# EAGLE design Entrenadorv01 (EAGLE 9.6.2)
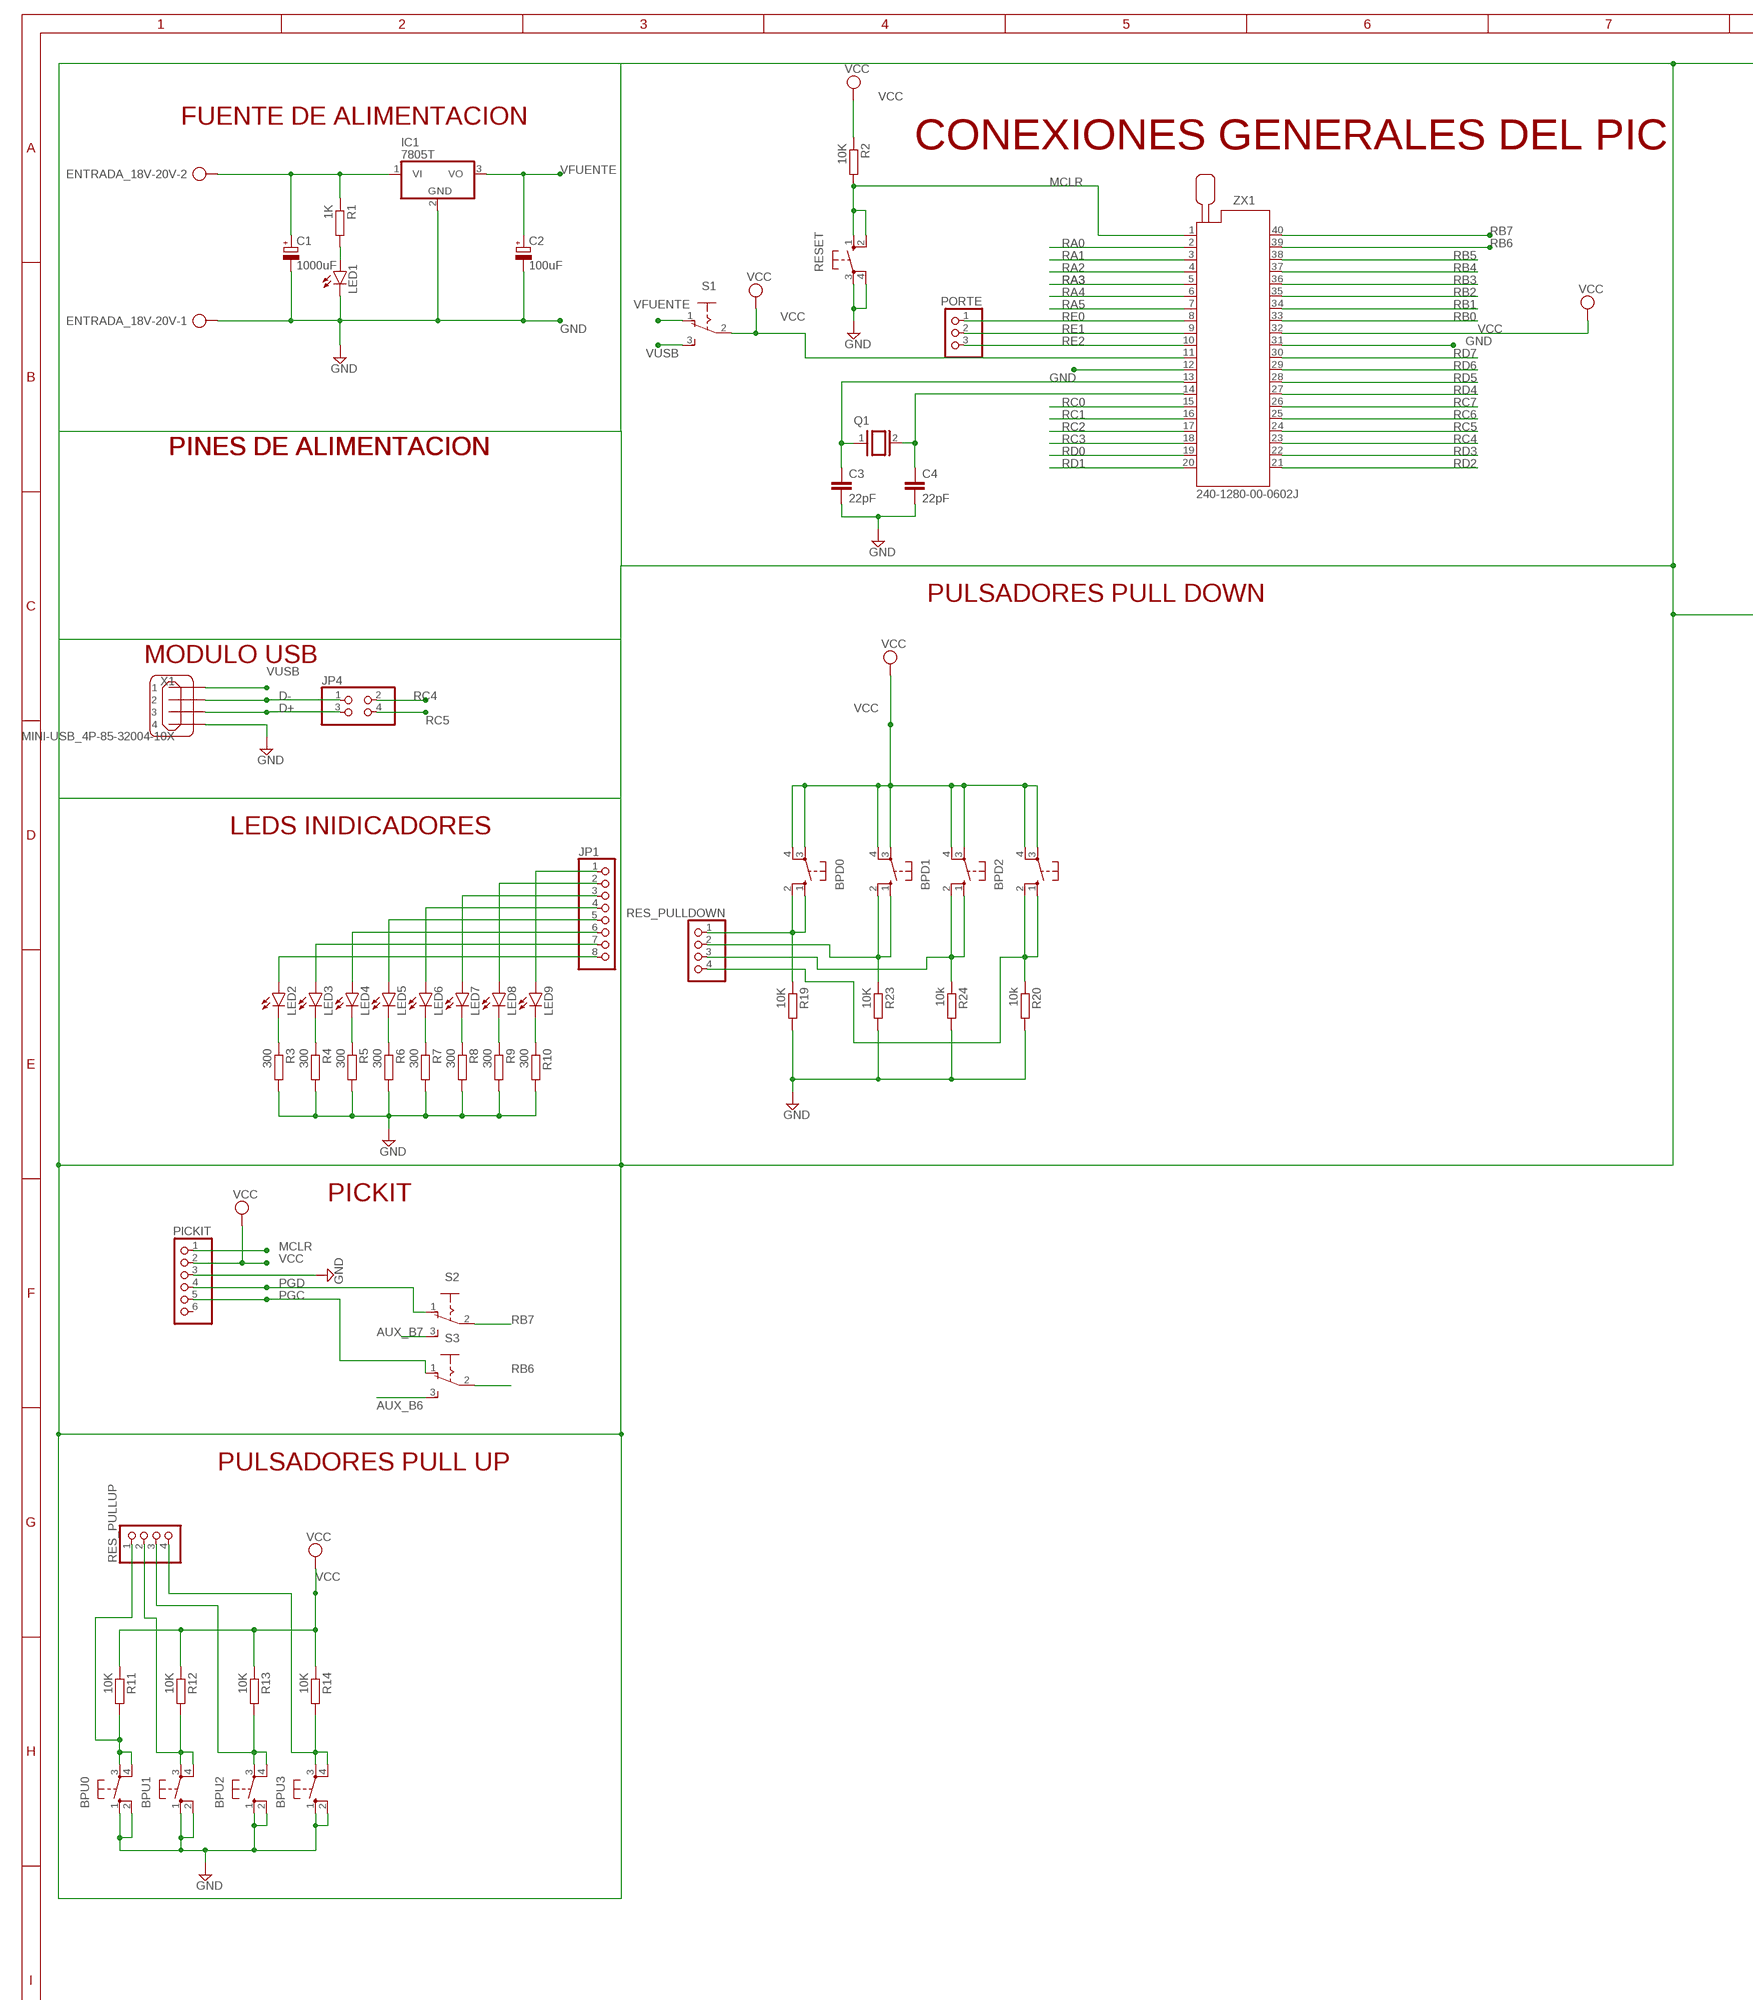
[diagram p0: schematic, sheet 1, part 1 of 2]
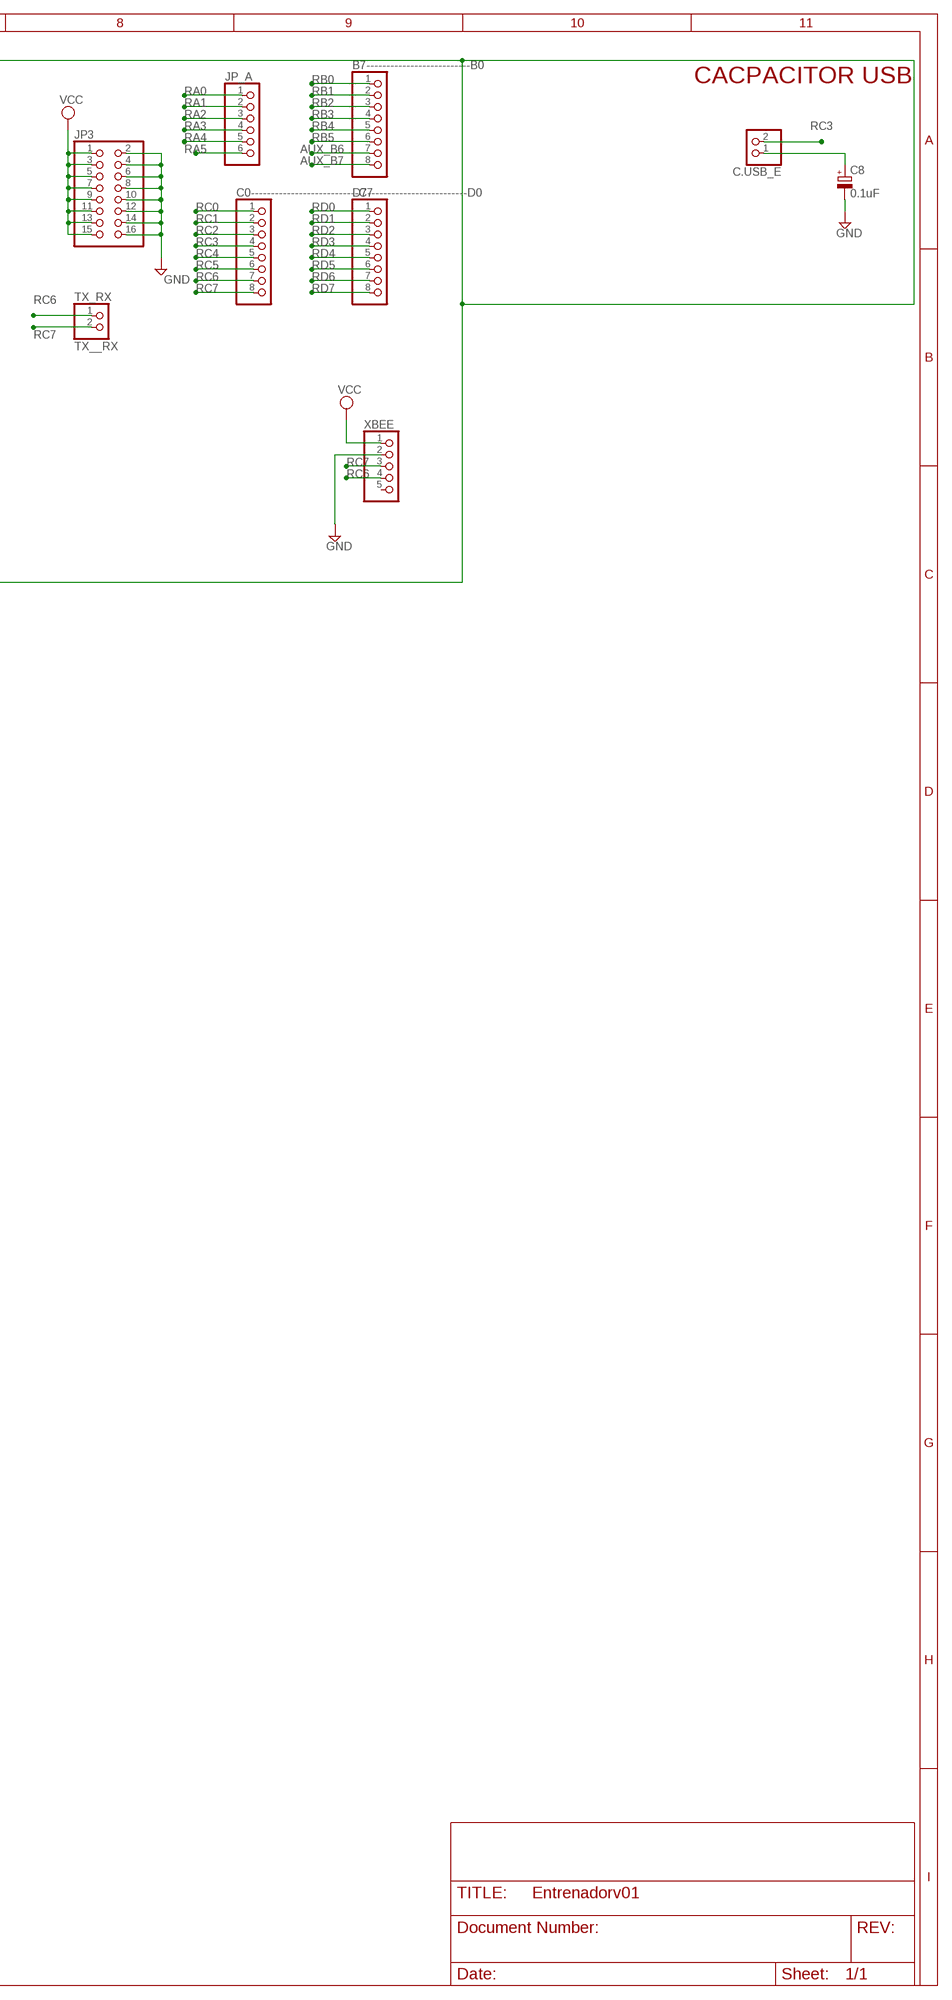
[diagram p1: schematic, sheet 1, part 2 of 2]

## Parts
B7--------------------------B0  PINHD-1X8  [1X08]
BPD0  10-XX  [B3F-10XX]
BPD1  10-XX  [B3F-10XX]
BPD2  10-XX  [B3F-10XX]
BPD3  10-XX  [B3F-10XX]
BPU0  10-XX  [B3F-10XX]
BPU1  10-XX  [B3F-10XX]
BPU2  10-XX  [B3F-10XX]
BPU3  10-XX  [B3F-10XX]
C0---------------------------C7  PINHD-1X8  [1X08]
C1  1000uF  CPOL-EUE5-10.5  [E5-10,5]
C2  100uF  CPOL-EUE5-10.5  [E5-10,5]
C3  22pF  C-EU025-025X050  [C025-025X050]
C4  22pF  C-EU025-025X050  [C025-025X050]
C8  0.1uF  CPOL-EUE1.8-4  [E1,8-4]
C.USB_E  PINHD-1X2  [1X02]
D7-------------------------D0  PINHD-1X8  [1X08]
ENTRADA_18V-20V  AK300/2  [AK300/2]
IC1  7805T  [TO220H]
JP1  PINHD-1X8  [1X08]
JP3  PINHD-2X8  [2X08]
JP4  PINHD-2X2  [2X02]
JP_A  PINHD-1X6  [1X06]
LED1  LED3MM  [LED3MM]
LED2  LED3MM  [LED3MM]
LED3  LED3MM  [LED3MM]
LED4  LED3MM  [LED3MM]
LED5  LED3MM  [LED3MM]
LED6  LED3MM  [LED3MM]
LED7  LED3MM  [LED3MM]
LED8  LED3MM  [LED3MM]
LED9  LED3MM  [LED3MM]
PICKIT  PINHD-1X6  [1X06]
PORTE  PINHD-1X3  [1X03]
Q1  XTAL/S  [QS]
R1  1K  R-EU_0207/10  [0207/10]
R2  10K  R-EU_0207/10  [0207/10]
R3  300  R-EU_0207/10  [0207/10]
R4  300  R-EU_0207/10  [0207/10]
R5  300  R-EU_0207/10  [0207/10]
R6  300  R-EU_0207/10  [0207/10]
R7  300  R-EU_0207/10  [0207/10]
R8  300  R-EU_0207/10  [0207/10]
R9  300  R-EU_0207/10  [0207/10]
R10  300  R-EU_0207/10  [0207/10]
R11  10K  R-EU_0207/10  [0207/10]
R12  10K  R-EU_0207/10  [0207/10]
R13  10K  R-EU_0207/10  [0207/10]
R14  10K  R-EU_0207/10  [0207/10]
R19  10K  R-EU_0207/10  [0207/10]
R20  10k  R-EU_0207/10  [0207/10]
R23  10K  R-EU_0207/10  [0207/10]
R24  10k  R-EU_0207/10  [0207/10]
RES_PULLDOWN  PINHD-1X4  [1X04]
RES_PULLUP  PINHD-1X4  [1X04]
RESET  10-XX  [B3F-10XX]
S1  M251  [M251]
S2  M251  [M251]
S3  M251  [M251]
TX_RX  TX__RX  PINHD-1X2  [1X02]
X1  MINI-USB_4P-85-32004-10X  [85-32004-10X]
XBEE  PINHD-1X5  [1X05]
ZX1  240-1280-00-0602J  [240-1280-00-0602J]

## Nets
AUX_B6: B7--------------------------B0.7 S3.3(S)
AUX_B7: B7--------------------------B0.8 S2.3(S)
D+: JP4.3 X1.3
D-: JP4.1 X1.2
GND: BPU0.1(S) BPU0.2(S1) BPU1.1(S) BPU1.2(S1) BPU2.1(S) BPU2.2(S1) BPU3.1(S) BPU3.2(S1) C1.- C2.- C3.2 C4.2 C8.- ENTRADA_18V-20V.1 IC1.2(GND) JP3.2 JP3.4 JP3.6 JP3.8 JP3.10 JP3.12 JP3.14 JP3.16 LED1.K(C) PICKIT.3 R3.2 R4.2 R5.2 R6.2 R7.2 R8.2 R9.2 R10.2 R19.2 R20.2 R23.2 R24.2 RESET.3(P) RESET.4(P1) X1.4 XBEE.2 ZX1.12 ZX1.31
MCLR: PICKIT.1 R2.2 RESET.1(S) RESET.2(S1) ZX1.1
N$1: C1.+ ENTRADA_18V-20V.2 IC1.1(VI) R1.1
N$2: BPU0.3(P) BPU0.4(P1) R11.2 RES_PULLUP.1
N$3: LED1.A R1.2
N$4: BPU1.3(P) BPU1.4(P1) R12.2 RES_PULLUP.2
N$5: C3.1 Q1.1 ZX1.13
N$6: C4.1 Q1.2 ZX1.14
N$7: BPD0.1(S) BPD0.2(S1) R19.1 RES_PULLDOWN.1
N$8: BPU2.3(P) BPU2.4(P1) R13.2 RES_PULLUP.3
N$9: BPU3.3(P) BPU3.4(P1) R14.2 RES_PULLUP.4
N$11: BPD1.1(S) BPD1.2(S1) R23.1 RES_PULLDOWN.2
N$16: BPD2.1(S) BPD2.2(S1) R24.1 RES_PULLDOWN.3
N$17: BPD3.1(S) BPD3.2(S1) R20.1 RES_PULLDOWN.4
N$43: LED2.K(C) R3.1
N$44: LED3.K(C) R4.1
N$45: LED4.K(C) R5.1
N$46: LED5.K(C) R6.1
N$47: LED6.K(C) R7.1
N$48: LED7.K(C) R8.1
N$49: LED8.K(C) R9.1
N$50: LED9.K(C) R10.1
N$51: JP1.1 LED9.A
N$52: JP1.2 LED8.A
N$53: JP1.3 LED7.A
N$54: JP1.4 LED6.A
N$55: JP1.5 LED5.A
N$56: JP1.6 LED4.A
N$57: JP1.7 LED3.A
N$58: JP1.8 LED2.A
N$99: C8.+ C.USB_E.1
PGC: PICKIT.5 S3.1(O)
PGD: PICKIT.4 S2.1(O)
RA0: JP_A.1 ZX1.2
RA1: JP_A.2 ZX1.3
RA2: JP_A.3 ZX1.4
RA3: JP_A.4 ZX1.5
RA4: JP_A.5 ZX1.6
RA5: JP_A.6 ZX1.7
RB0: B7--------------------------B0.1 ZX1.33
RB1: B7--------------------------B0.2 ZX1.34
RB2: B7--------------------------B0.3 ZX1.35
RB3: B7--------------------------B0.4 ZX1.36
RB4: B7--------------------------B0.5 ZX1.37
RB5: B7--------------------------B0.6 ZX1.38
RB6: S3.2(P) ZX1.39
RB7: S2.2(P) ZX1.40
RC0: C0---------------------------C7.1 ZX1.15
RC1: C0---------------------------C7.2 ZX1.16
RC2: C0---------------------------C7.3 ZX1.17
RC3: C0---------------------------C7.4 C.USB_E.2 ZX1.18
RC4: C0---------------------------C7.5 JP4.2 ZX1.23
RC5: C0---------------------------C7.6 JP4.4 ZX1.24
RC6: C0---------------------------C7.7 TX_RX.1 XBEE.4 ZX1.25
RC7: C0---------------------------C7.8 TX_RX.2 XBEE.3 ZX1.26
RD0: D7-------------------------D0.1 ZX1.19
RD1: D7-------------------------D0.2 ZX1.20
RD2: D7-------------------------D0.3 ZX1.21
RD3: D7-------------------------D0.4 ZX1.22
RD4: D7-------------------------D0.5 ZX1.27
RD5: D7-------------------------D0.6 ZX1.28
RD6: D7-------------------------D0.7 ZX1.29
RD7: D7-------------------------D0.8 ZX1.30
RE0: PORTE.1 ZX1.8
RE1: PORTE.2 ZX1.9
RE2: PORTE.3 ZX1.10
VCC: BPD0.3(P) BPD0.4(P1) BPD1.3(P) BPD1.4(P1) BPD2.3(P) BPD2.4(P1) BPD3.3(P) BPD3.4(P1) JP3.1 JP3.3 JP3.5 JP3.7 JP3.9 JP3.11 JP3.13 JP3.15 PICKIT.2 R2.1 R11.1 R12.1 R13.1 R14.1 S1.2(P) XBEE.1 ZX1.11 ZX1.32
VFUENTE: C2.+ IC1.3(VO) S1.1(O)
VUSB: S1.3(S) X1.1
Unconnected: PICKIT.6 XBEE.5

## Notes on the sheet
- CACPACITOR USB
- FUENTE DE ALIMENTACION
- CONEXIONES GENERALES DEL PIC
- PINES DE ALIMENTACION | PINES DE ALIMENTACION | PINES DE ALIMENTACION
- PULSADORES PULL DOWN
- MODULO USB
- LEDS INIDICADORES
- PICKIT
- PULSADORES PULL UP

## Library data of the parts
B7--------------------------B0 C0---------------------------C7 D7-------------------------D0 JP1 = pinhead:PINHD-1X8: PIN HEADER
BPD0 BPD1-BPD3 BPU0 BPU1-BPU3 RESET = switch-omron:10-XX: OMRON SWITCH; MPN: B3F-1000; OC_FARNELL: 176432; OC_NEWARK: 36M3542
C1 C2 C8 = rcl:CPOL-EU: POLARIZED CAPACITOR, European symbol; SPICEPREFIX: C
C3 C4 = rcl:C-EU: CAPACITOR, European symbol; SPICEPREFIX: C
C.USB_E TX_RX = pinhead:PINHD-1X2: PIN HEADER
ENTRADA_18V-20V = con-ptr500:AK300/2: CONNECTOR; OC_FARNELL: unknown; OC_NEWARK: unknown
IC1 = linear:78*: Positive VOLTAGE REGULATOR Source: http://cache.national.com/ds/LM/LM78L05.pdf http://www.fairchildsemi.com/ds/LM/LM7805.pdf
JP3 = pinhead:PINHD-2X8: PIN HEADER
JP4 = pinhead:PINHD-2X2: PIN HEADER
JP_A PICKIT = pinhead:PINHD-1X6: PIN HEADER
LED1-LED9 = mi_led:LED: LED OSRAM: - CHIPLED LG R971, LG N971, LY N971, LG Q971, LY Q971, LO R971, LY R971 LH N974, LH R974 LS Q976, LO Q976, LY Q976 LO Q996 - Hyper CHIPLED LW Q18S LB Q993, LB Q99A, LB R99A - SideLED LS A670, LO A670, LY A670, LG A670, LP A670 LB A673, LV A673, LT A673, LW A673 LH A674 LY A675 LS A676, LA A676, LO A676, LY A676, LW A676 LS A679, LY A679, LG A679 - Hyper Micro SIDELED® LS Y876, LA Y876, LO Y876, LY Y876 LT Y87S - SmartLED LW L88C, LW L88S LB L89C, LB L89S, LG L890 LS L89K, LO L89K, LY L89K LS L896, LA L896, LO L896, LY L896 - TOPLED LS T670, LO T670, LY T670, LG T670, LP T670 LSG T670, LSP T670, LSY T670, LOP T670, LYG T670 LG T671, LOG T671, LSG T671 LB T673, LV T673, LT T673, LW T673 LH T674 LS T676, LA T676, LO T676, LY T676, LB T676, LH T676, LSB T676, LW T676 LB T67C, LV T67C, LT T67C, LS T67K, LO T67K, LY T67K, LW E67C LS E67B, LA E67B, LO E67B, LY E67B, LB E67C, LV E67C, LT E67C LW T67C LS T679, LY T679, LG T679 LS T770, LO T770, LY T770, LG T770, LP T770 LB T773, LV T773, LT T773, LW T773 LH T774 LS E675, LA E675, LY E675, LS T675 LS T776, LA T776, LO T776, LY T776, LB T776 LHGB T686 LT T68C, LB T68C - Hyper Mini TOPLED® LB M676 - Mini TOPLED Santana® LG M470 LS M47K, LO M47K, LY M47K Source: http://www.osram.convergy.de LUXEON: - LUMILED® LXK2-PW12-R00, LXK2-PW12-S00, LXK2-PW14-U00, LXK2-PW14-V00 LXK2-PM12-R00, LXK2-PM12-S00, LXK2-PM14-U00 LXK2-PE12-Q00, LXK2-PE12-R00, LXK2-PE12-S00, LXK2-PE14-T00, LXK2-PE14-U00 LXK2-PB12-K00, LXK2-PB12-L00, LXK2-PB12-M00, LXK2-PB14-N00, LXK2-PB14-P00, LXK2-PB14-Q00 LXK2-PR12-L00, LXK2-PR12-M00, LXK2-PR14-Q00, LXK2-PR14-R00 LXK2-PD12-Q00, LXK2-PD12-R00, LXK2-PD12-S00 LXK2-PH12-R00, LXK2-PH12-S00 LXK2-PL12-P00, LXK2-PL12-Q00, LXK2-PL12-R00 Source: www.luxeon.com KINGBRIGHT: KA-3528ASYC Source: www.kingbright.com
PORTE = pinhead:PINHD-1X3: PIN HEADER
Q1 = special:XTAL/S: CRYSTAL
R1-R14 R19 R20 R23 R24 = rcl:R-EU_: RESISTOR, European symbol; SPICEPREFIX: R
RES_PULLDOWN RES_PULLUP = pinhead:PINHD-1X4: PIN HEADER
S1-S3 = switch:M251: SLIDING SWITCH Mors, distributor Buerklin, 11G702
X1 = con-cypressindustries:MINI-USB_4P-: MINI USB 4 Pol. Source: www.cypressindustries.com; OC_FARNELL: unknown; OC_NEWARK: unknown
XBEE = pinhead:PINHD-1X5: PIN HEADER
ZX1 = con-3m:240-?-00-0602J: Zero Insertion Force Socked Source: http://www.3M.com/ehpd; MF: 3M; MPN: 240-1280-00-0602J; OC_FARNELL: 9897364; OC_NEWARK: 85K7848

## Board
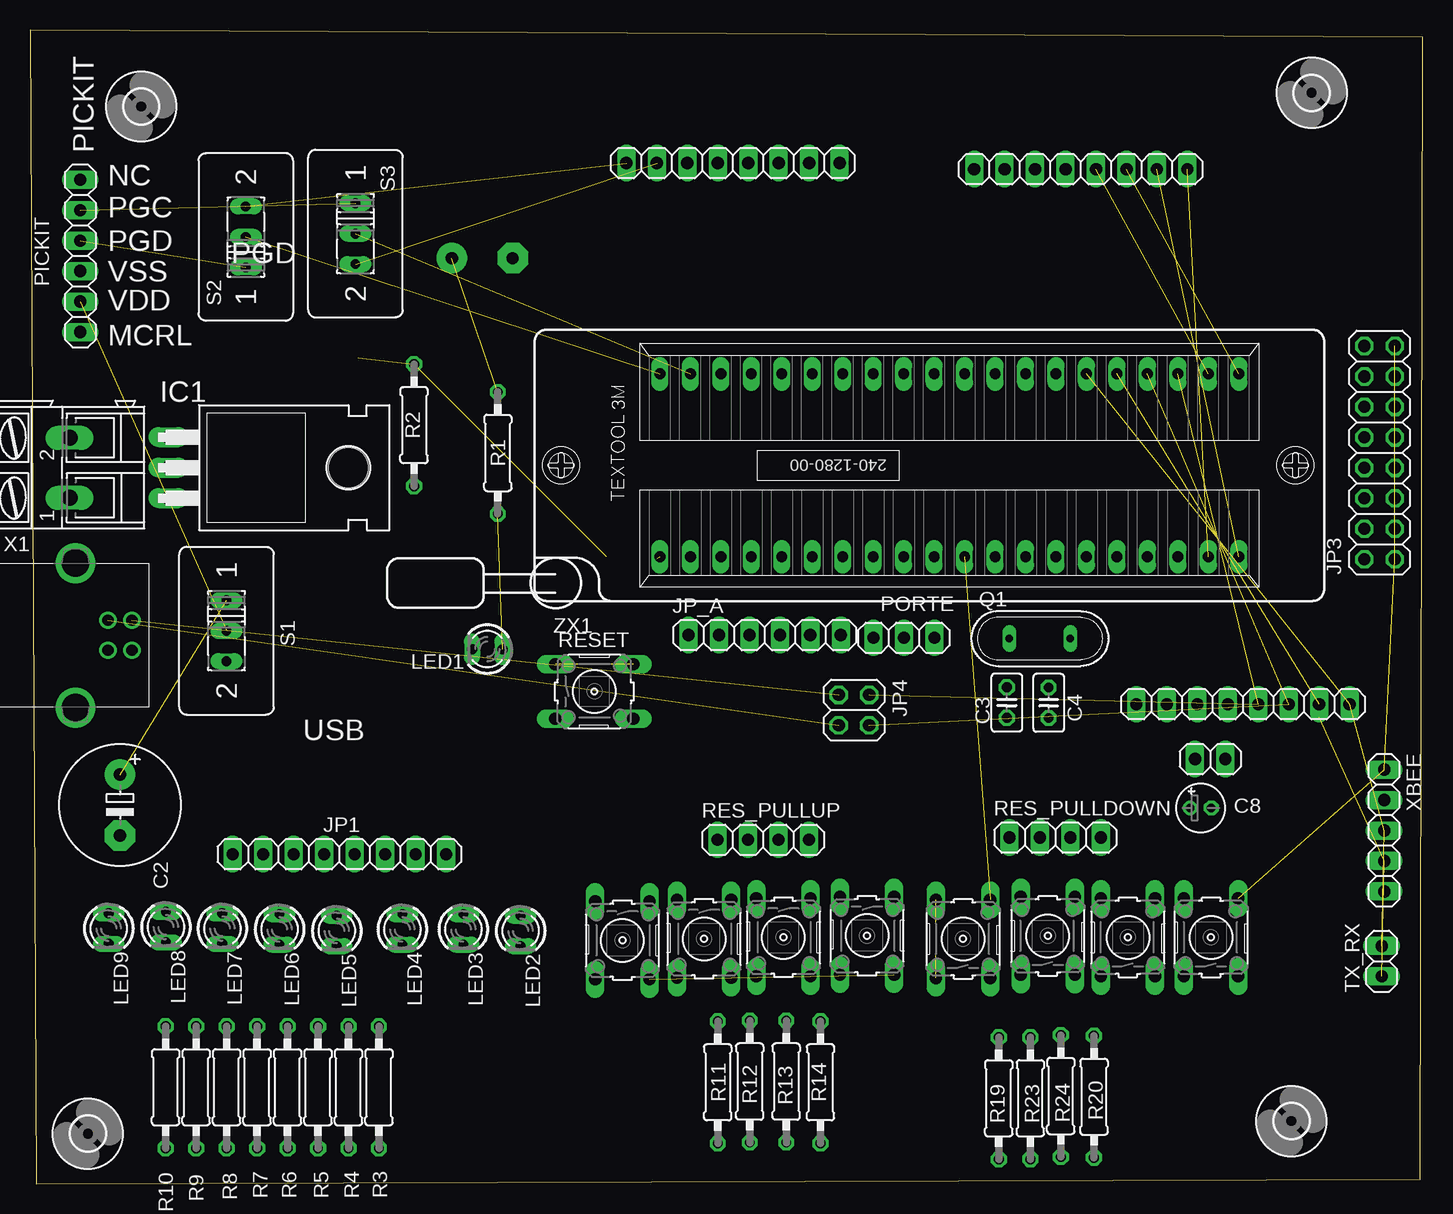
[diagram p2: board, top side]
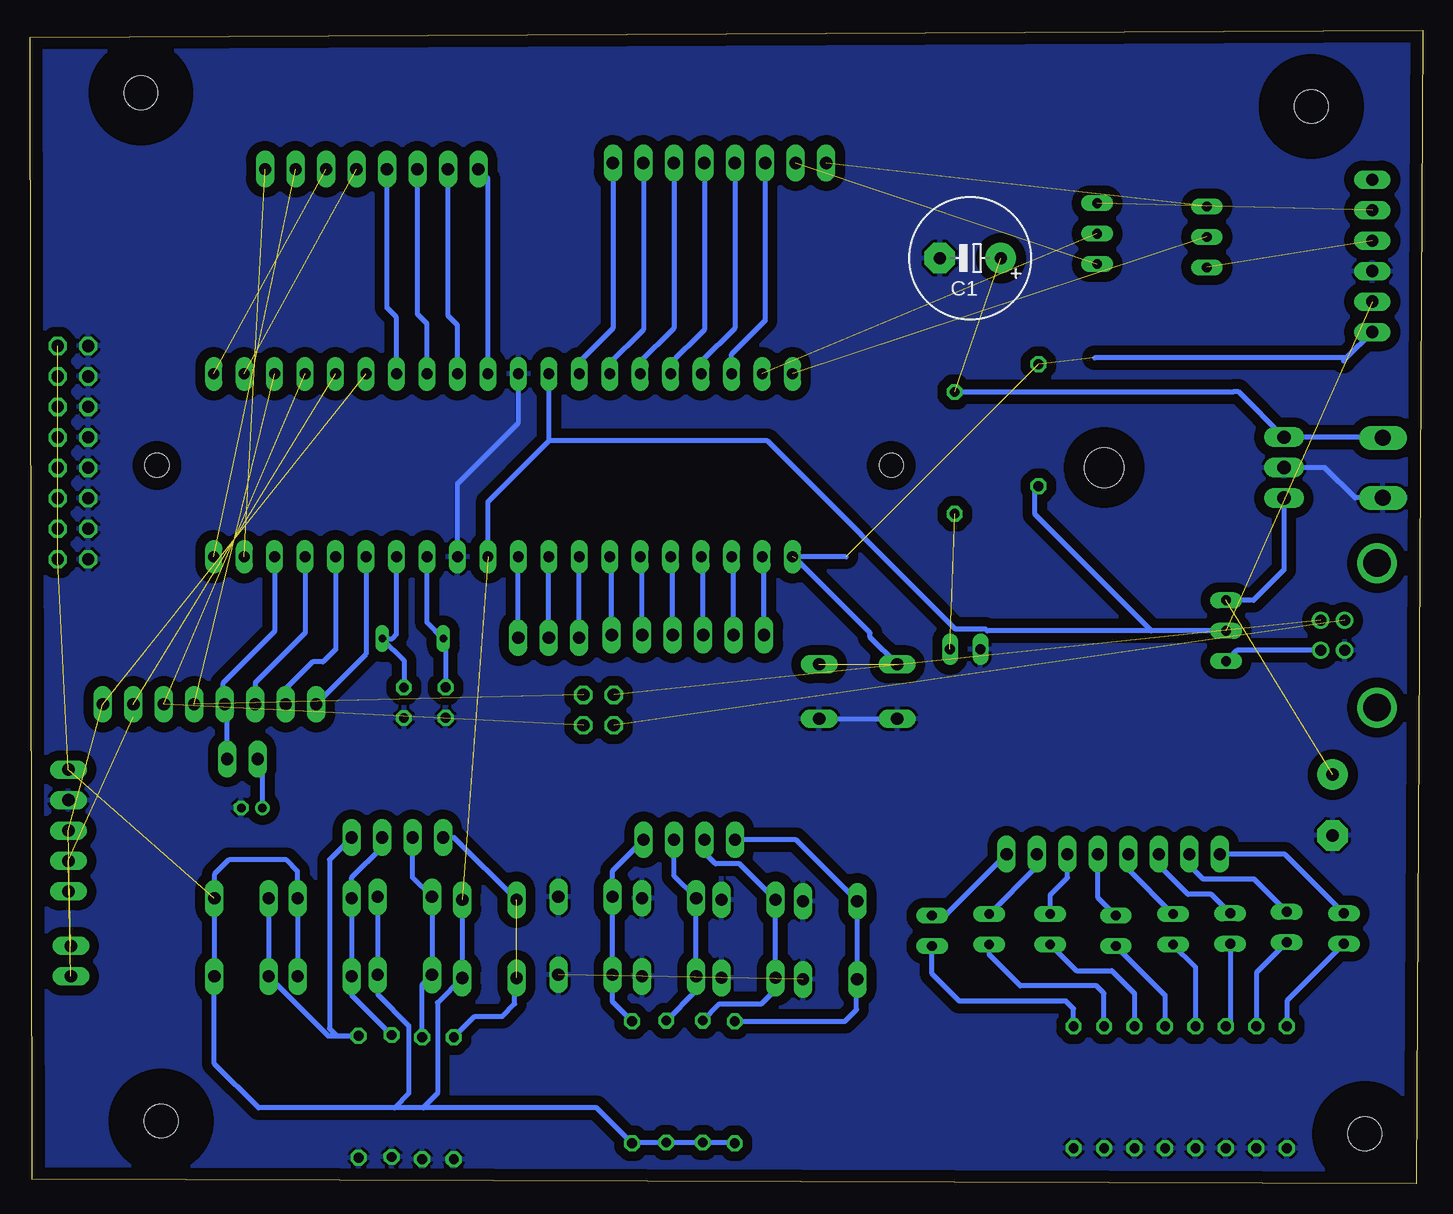
[diagram p3: board, bottom side, seen from below]

Size 116.09 x 96.16 mm. Coordinates in mm from the lower left corner, seen from the top.
Outline: 0.51,0 115.9,0.38 116.09,95.56 0,96.16 0.51,0
Copper layers (1*16): Top 0.035mm / dielectric 1.5mm / Bottom 0.035mm
Design rules "default": minimum track width 6mil, minimum drill 0.35mm, track to track 6mil, track to pad 6mil, pad to pad 6mil, via to via 6mil, smd to smd 6mil, copper to edge 40mil, drill to drill 6mil, minimum pad ring 10mil, minimum via ring 8mil, stop-mask expansion 4mil, vias tented up to drill 0mil, thermal gap 10mil

### Footprints (pad centres in the part's own frame; a part is rotated, then mirrored left to right if it is on the bottom)
1X08 = drill 1.016 long: 1 -8.89,0; 2 -6.35,0; 3 -3.81,0; 4 -1.27,0; 5 1.27,0; 6 3.81,0; 7 6.35,0; 8 8.89,0
B3F-10XX = drill 1.016 long: 1 -3.251,2.261; 2 3.251,2.261; 3 -3.251,-2.261; 4 3.251,-2.261
E5-10,5 = drill 1.016 pad 2.54: + -2.54,0 | drill 1.016 pad 2.54 octagon: - 2.54,0
C025-025X050 = drill 0.813 octagon: 1 -1.27,0; 2 1.27,0
E1,8-4 = drill 0.711 pad 1.168: + -0.889,0 | drill 0.711 pad 1.168 octagon: - 0.889,0
1X02 = drill 1.016 long: 1 -1.27,0; 2 1.27,0
AK300/2 = drill 1.321 long: 1 -2.515,0; 2 2.489,0
TO220H = drill 1.118 long: 1 -2.54,-10.16; 2 0,-10.16; 3 2.54,-10.16 | hole 3.302: 0,4.826
2X08 = drill 1.016 octagon: 1 -8.89,-1.27; 2 -8.89,1.27; 3 -6.35,-1.27; 4 -6.35,1.27; 5 -3.81,-1.27; 6 -3.81,1.27; 7 -1.27,-1.27; 8 -1.27,1.27; 9 1.27,-1.27; 10 1.27,1.27; 11 3.81,-1.27; 12 3.81,1.27; 13 6.35,-1.27; 14 6.35,1.27; 15 8.89,-1.27; 16 8.89,1.27
2X02 = drill 1.016 octagon: 1 -1.27,-1.27; 2 -1.27,1.27; 3 1.27,-1.27; 4 1.27,1.27
1X06 = drill 1.016 long: 1 -6.35,0; 2 -3.81,0; 3 -1.27,0; 4 1.27,0; 5 3.81,0; 6 6.35,0
LED3MM = drill 0.813 long: A -1.27,0; K 1.27,0
1X03 = drill 1.016 long: 1 -2.54,0; 2 0,0; 3 2.54,0
QS = drill 0.61 long: 1 -2.54,0; 2 2.54,0
0207/10 = drill 0.813 octagon: 1 -5.08,0; 2 5.08,0
1X04 = drill 1.016 long: 1 -3.81,0; 2 -1.27,0; 3 1.27,0; 4 3.81,0
M251 = drill 0.813 long: 1 -2.54,0; 2 0,0; 3 2.54,0
2,8 = hole 2.8: 0,0
85-32004-10X = drill 0.92 pad 1.27: 1 4.71,-1.25; 2 4.71,1.25; 3 2.71,1.25; 4 2.71,-1.25 | drill 2.3 pad 3: M1 0,6.02; M2 0,-6.02
1X05 = drill 1.016 long: 1 -5.08,0; 2 -2.54,0; 3 0,0; 4 2.54,0; 5 5.08,0
240-1280-00-0602J = drill 0.9 long: 1 -24.13,-7.62; 2 -21.59,-7.62; 3 -19.05,-7.62; 4 -16.51,-7.62; 5 -13.97,-7.62; 6 -11.43,-7.62; 7 -8.89,-7.62; 8 -6.35,-7.62; 9 -3.81,-7.62; 10 -1.27,-7.62; 11 1.27,-7.62; 12 3.81,-7.62; 13 6.35,-7.62; 14 8.89,-7.62; 15 11.43,-7.62; 16 13.97,-7.62; 17 16.51,-7.62; 18 19.05,-7.62; 19 21.59,-7.62; 20 24.13,-7.62; 21 24.13,7.62; 22 21.59,7.62; 23 19.05,7.62; 24 16.51,7.62; 25 13.97,7.62; 26 11.43,7.62; 27 8.89,7.62; 28 6.35,7.62; 29 3.81,7.62; 30 1.27,7.62; 31 -1.27,7.62; 32 -3.81,7.62; 33 -6.35,7.62; 34 -8.89,7.62; 35 -11.43,7.62; 36 -13.97,7.62; 37 -16.51,7.62; 38 -19.05,7.62; 39 -21.59,7.62; 40 -24.13,7.62 | hole 2: 28.86,0; -32.36,0

### Placement (x,y rotation side)
B7--------------------------B0  58.61,85.08 180 top
BPD0  77.79,20.42 90 top
BPD1  84.84,20.67 90 top
BPD2  91.52,20.55 90 top
BPD3  98.45,20.55 90 top
BPU0  49.39,20.3 270 top
BPU1  56.19,20.43 270 top
BPU2  62.81,20.55 270 top
BPU3  69.78,20.69 270 top
C0---------------------------C7  101.12,39.98 0 top
C1  37.7,77.15 180 bottom
C2  7.5,31.58 270 top
C3  81.43,40.12 270 top
C4  84.92,40.1 270 top
C8  97.59,31.34 0 top
C.USB_E  98.39,35.41 0 top
D7-------------------------D0  87.6,84.57 180 top
ENTRADA_18V-20V  3.3,59.69 90 top
IC1  21.72,59.69 270 top
JP1  25.79,27.49 0 top
JP3  112.51,60.95 90 top
JP4  68.69,39.49 270 top
JP_A  61.24,45.74 0 top
LED1  38.12,44.56 180 top
LED2  40.89,21.09 270 top
LED3  36.12,21.22 270 top
LED4  31.03,21.22 270 top
LED5  25.57,21.1 270 top
LED6  20.8,21.22 270 top
LED7  16.03,21.29 270 top
LED8  11.33,21.41 270 top
LED9  6.56,21.28 270 top
PICKIT  4.19,77.34 90 top
PORTE  72.84,45.52 0 top
Q1  84.17,45.45 0 top
R1  39,60.92 270 top
R2  32.02,63.23 90 top
R3  29.09,8.05 270 top
R4  26.55,8.05 270 top
R5  24.01,8.05 270 top
R6  21.47,8.05 270 top
R7  18.93,8.05 270 top
R8  16.39,8.05 270 top
R9  13.85,8.05 270 top
R10  11.31,8.05 270 top
R11  57.33,8.47 90 top
R12  60,8.53 90 top
R13  63.04,8.53 90 top
R14  65.9,8.47 90 top
R19  80.76,7.14 270 top
R20  88.7,7.27 270 top
R23  83.4,7.14 270 top
R24  85.93,7.33 270 top
RES_PULLDOWN  85.46,28.86 0 top
RES_PULLUP  61.12,28.68 0 top
RESET  47.04,41.04 0 top
S1  16.38,46.1 270 top
S2  17.99,78.92 90 top
S3  27.13,79.19 270 top
TX_RX  112.67,18.57 90 top
U$3  [2,8]  4.83,4.19 0 top
U$4  [2,8]  105.15,5.24 0 top
U$5  [2,8]  9.27,89.79 0 top
U$6  [2,8]  106.84,90.93 0 top
X1  3.79,45.71 0 top
XBEE  112.88,29.45 270 top
ZX1  76.64,59.89 0 top

### Tracks (layer width: path | path; a pad name or v marks a point on that pad's centre or on a via)
AUX_B6  (1 unrouted)
  Bottom 0.152: 52.27,85.1 B7--------------------------B0.7
AUX_B7  (1 unrouted)
D+  (1 unrouted)
D-  (1 unrouted)
GND  (3 unrouted)
  Bottom 0.406: ZX1.12 80.45,58.36 75.37,63.44 ZX1.31 | RESET.4 RESET.3 | ENTRADA_18V-20V.1 5.61,57.17 8.13,59.69 IC1.2
  pour Bottom (isolate 0.813): 0.51,95.32 115.05,95.32 115.05,1.27 0.51,1.27
MCLR  (4 unrouted)
  Bottom 0.152: 52.26,52.52 ZX1.1
  Bottom 0.406: 52.26,52.14 46.05,45.94 46.05,45.56 RESET.1 | PICKIT.1 6.35,68.84 | 6.35,68.84 6.6,68.58 | 48.06,52.27 ZX1.1 | 6.35,68.84 27.35,68.84
N$1  (1 unrouted)
  Bottom 0.406: ENTRADA_18V-20V.2 3.35,62.23 IC1.1 15.37,66.04 15.75,66.04 15.79,66 R1.1
N$2
  Bottom 0.152: 47.18,17 BPU0.4
  Bottom 0.406: RES_PULLUP.1 52.25,28.68 BPU0.3 BPU0.4 | R11.2 48.16,13.55 47.18,14.53 47.18,17
N$3  (1 unrouted)
N$4
  Bottom 0.406: RES_PULLUP.2 59.85,27.59 58.93,26.67 56.92,26.67 BPU1.3 BPU1.4 53.93,16.18 55.11,15 58.61,15 R12.2
N$5
  Bottom 0.406: ZX1.13 82.99,46.81 Q1.1 81.43,45.25 C3.1
N$6
  Bottom 0.406: ZX1.14 85.53,45.79 85.87,45.45 Q1.2 84.92,43.66 C4.1
N$7  (1 unrouted)
  Bottom 0.152: 75.68,17.02 BPD0.1
  Bottom 0.406: BPD0.2 80.72,28.86 RES_PULLDOWN.1 | R19.1 79.01,13.97 76.71,13.97 75.68,15 75.68,17.02
N$8
  Bottom 0.406: RES_PULLUP.3 62.39,25.65 60.63,23.88 BPU2.3 BPU2.4 60.55,16.11 R13.2
N$9
  Bottom 0.406: RES_PULLUP.4 67.52,26.09 67.52,24 BPU3.3 BPU3.4 67.52,15.17 R14.2
N$11
  Bottom 0.406: RES_PULLDOWN.2 84.19,25.54 BPD1.2 BPD1.1 83.39,16.61 R23.1
N$16
  Bottom 0.406: RES_PULLDOWN.3 86.73,28.07 89.26,25.55 BPD2.2 BPD2.1 89.26,15.74 R24.1
N$17
  Bottom 0.406: BPD3.2 BPD3.1 91.24,12.35 90.51,12.35 | 90.51,12.35 R20.1 | RES_PULLDOWN.4 91.11,27.03 91.11,12.95 90.51,12.35
N$43
  Bottom 0.406: R3.1 29.09,14.61 29.72,15.24 38.61,15.24 40.89,17.52 LED2.K
N$44
  Bottom 0.406: R4.1 26.55,15.88 27.18,16.51 33.53,16.51 36.12,19.1 LED3.K
N$45
  Bottom 0.406: LED4.K 28.86,17.78 25.91,17.78 24.01,15.88 R5.1
N$46
  Bottom 0.406: LED5.K 21.47,15.73 R6.1
N$47
  Bottom 0.406: LED6.K 18.93,18.08 R7.1
N$48
  Bottom 0.406: LED7.K 16.03,13.49 R8.1
N$49
  Bottom 0.406: LED8.K 13.85,17.62 R9.1
N$50
  Bottom 0.406: LED9.K 11.31,15.26 R10.1
N$51
  Bottom 0.406: LED9.A 11.49,27.49 JP1.1
N$52
  Bottom 0.406: LED8.A 14.04,25.4 18.29,25.4 19.56,26.67 19.56,27.36 JP1.2
N$53
  Bottom 0.406: LED7.A 17.61,24.13 19.56,24.13 21.98,26.55 JP1.3
N$54
  Bottom 0.406: LED6.A 24.52,26.21 JP1.4
N$55
  Bottom 0.406: LED5.A 27.06,23.86 JP1.5
N$56
  Bottom 0.406: LED4.A 31.03,24.08 29.6,25.52 JP1.6
N$57
  Bottom 0.406: LED3.A 32.14,26.47 JP1.7
N$58
  Bottom 0.406: JP1.8 39.8,22.36 LED2.A
N$99
  Bottom 0.406: C8.+ 96.7,34.99 C.USB_E.1
PGC  (1 unrouted)
PGD  (1 unrouted)
RA0
  Bottom 0.254: 54.93,45.7 JP_A.1
  Bottom 0.406: JP_A.1 54.89,52.1 ZX1.2
RA1
  Bottom 0.254: 57.47,52.14 ZX1.3
  Bottom 0.406: JP_A.2 57.43,52.1 57.47,52.14
RA2
  Bottom 0.254: 59.97,52.1 ZX1.4
  Bottom 0.406: JP_A.3 59.97,52.1
RA3
  Bottom 0.152: 62.65,45.59 JP_A.4 62.54,45.71 | 62.61,52.2 ZX1.5
  Bottom 0.254: 62.55,52.14 62.61,52.2
  Bottom 0.406: JP_A.4 62.51,52.1 62.55,52.14
RA4
  Bottom 0.152: 65.2,45.9 JP_A.5 65.21,45.9
  Bottom 0.254: 65.05,52.1 ZX1.6
  Bottom 0.406: JP_A.5 65.05,52.1
RA5
  Bottom 0.152: 67.74,45.9 JP_A.6 | 67.59,52.1 ZX1.7
  Bottom 0.406: JP_A.6 67.59,52.1
RB0
  Bottom 0.152: 67.49,84.53 B7--------------------------B0.1
  Bottom 0.406: B7--------------------------B0.1 67.49,71.32 70.29,68.52 ZX1.33
RB1
  Bottom 0.152: B7--------------------------B0.2 65,85.03
  Bottom 0.406: B7--------------------------B0.2 64.96,71.19 67.88,68.27 67.88,67.63 ZX1.34
RB2
  Bottom 0.406: B7--------------------------B0.3 62.41,71.32 65.34,68.4 65.34,67.63 ZX1.35
RB3
  Bottom 0.152: B7--------------------------B0.4 59.88,74.34 59.86,74.33
  Bottom 0.406: B7--------------------------B0.4 59.88,71.19 62.8,68.27 62.8,67.63 ZX1.36
RB4
  Bottom 0.406: B7--------------------------B0.5 57.34,71.32 60.13,68.52 ZX1.37
RB5
  Bottom 0.152: B7--------------------------B0.6 54.8,86.03
  Bottom 0.254: 57.59,69.15 57.59,69.16
  Bottom 0.406: B7--------------------------B0.6 54.8,71.94 57.59,69.15 ZX1.38
RB6  (1 unrouted)
RB7  (1 unrouted)
RC0
  Bottom 0.152: 88.07,44.15 88.06,44.14
  Bottom 0.406: C0---------------------------C7.1 92.23,40 88.07,44.15 ZX1.15
RC1
  Bottom 0.152: C0---------------------------C7.2 94.77,40.08 | 94.77,40.2 94.77,40.38
  Bottom 0.254: 94.77,40.39 94.77,40.2 94.77,40.08
  Bottom 0.406: ZX1.16 90.61,44.55 | 90.61,44.55 90.6,44.54 | 90.61,44.55 91.65,43.5 92.52,43.5 94.77,41.26 94.77,40.2
RC2
  Bottom 0.152: 93.14,45.95 93.15,45.94
  Bottom 0.254: 97.31,41.26 97.31,40.2 C0---------------------------C7.3
  Bottom 0.406: ZX1.17 93.15,45.95 93.14,45.95 97.31,41.79 97.31,40.2
RC3
  Bottom 0.152: 99.86,40 C0---------------------------C7.4 | C.USB_E.2 99.78,35.28
  Bottom 0.254: 100.01,41.34 100.01,40.33 100.01,40.15 99.91,40.05 99.86,40
  Bottom 0.406: ZX1.18 95.69,46.04 100.01,41.73 100.01,40.33 | 99.26,39.39 99.66,39.79 | 99.91,40.05 99.79,39.92 99.66,39.79 | C.USB_E.2 99.66,39.79
RC4  (2 unrouted)
RC5  (2 unrouted)
  Bottom 0.152: ZX1.24
  Bottom 0.254: 104.96,39.95 C0---------------------------C7.6
RC6  (3 unrouted)
  Bottom 0.254: 107.47,38.9 C0---------------------------C7.7
RC7  (3 unrouted)
  Bottom 0.152: ZX1.26
RD0  (1 unrouted)
RD1  (1 unrouted)
RD2  (1 unrouted)
RD3  (1 unrouted)
RD4
  Bottom 0.152: ZX1.27
  Bottom 0.406: ZX1.27 85.53,72.21 86.33,73 D7-------------------------D0.5
RD5
  Bottom 0.406: ZX1.28 82.99,71.7 83.79,72.5 D7-------------------------D0.6
RD6
  Bottom 0.152: ZX1.29
  Bottom 0.406: ZX1.29 80.45,71.57 81.25,72.37 D7-------------------------D0.7
RD7
  Bottom 0.406: ZX1.30 77.91,83.77 D7-------------------------D0.8
RE0
  Bottom 0.152: ZX1.8
  Bottom 0.254: 70.29,45.53 PORTE.1
  Bottom 0.406: PORTE.1 70.3,52.26 ZX1.8
RE1
  Bottom 0.152: ZX1.9
  Bottom 0.254: 72.83,45.53 PORTE.2
  Bottom 0.406: PORTE.2 72.84,52.24 ZX1.9
RE2
  Bottom 0.152: ZX1.10
  Bottom 0.254: 75.37,45.53 PORTE.3
  Bottom 0.406: PORTE.3 75.38,52.24 ZX1.10
VCC  (11 unrouted)
  Bottom 0.152: 114.16,70.22 JP3.15
  Bottom 0.406: ZX1.11 77.91,56.84 72.83,61.92 | 72.83,61.92 ZX1.32 | 80.05,22.06 BPD0.4 BPD0.3 82.11,15.11 82.11,7.55 83.31,6.35 | BPD1.4 BPD1.3 87.1,15.8 84.51,13.2 84.51,7.55 85.71,6.35 | BPD2.3 BPD2.4 93.78,26.08 94.71,27 99.51,27 100.71,25.79 BPD3.4 BPD3.3 100.71,10.04 97.03,6.35 85.71,6.35 | 83.31,6.35 68.85,6.35 R14.1 65.83,3.45 R13.1 R12.1 57.4,3.45 R11.1 | 83.31,6.35 85.71,6.35 | R2.1 32.31,57.86 32.31,55.8 22.61,46.1 S1.2 36.29,46.1 36.43,46.24 38.95,46.24 54.63,61.92 72.83,61.92
VFUENTE  (1 unrouted)
  Bottom 0.406: IC1.3 11.56,51.18 14.1,48.64 S1.1
VUSB
  Bottom 0.406: X1.1 15.48,44.46 S1.3

### Text on the board
tNames: PICKIT | NC | PGC | PGD | PGD | VSS | VDD | MCRL | USB
tValues: ENTRENADOR DE PIC'S / Ing. JUAN SEBASTIAN CORREA / V2.0 / FINES: / EDUCATIVOS/NO COMERCIALES | PUSH / PULLDOWN